# EAGLE schematic Powerswitch 2 Dioda dan MPU6050 (EAGLE 9.6.2)
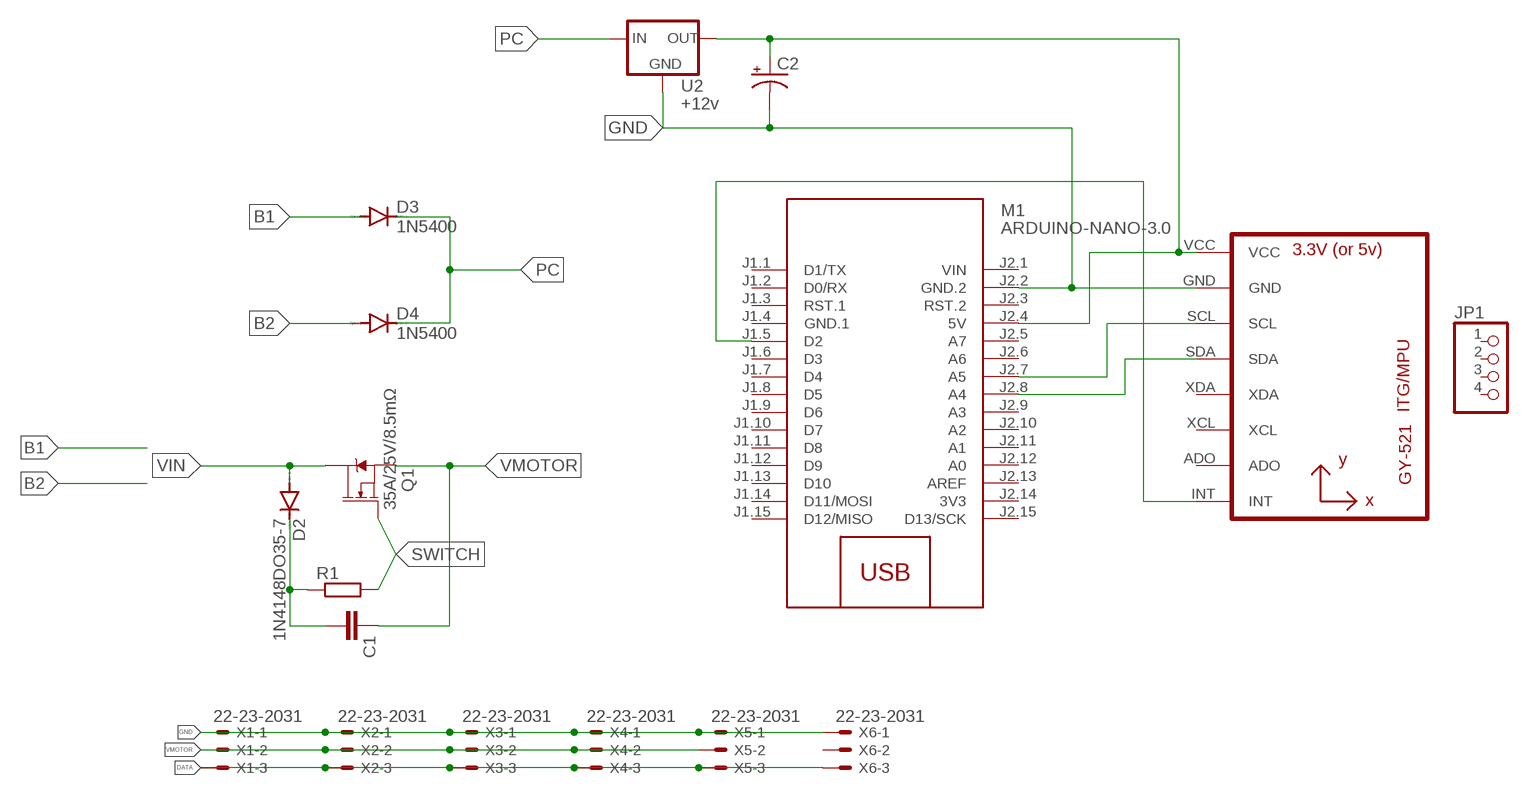
[diagram p0: schematic, sheet 1]

## Parts
C1  C-EU025-030X050  [C025-030X050]
C2  CPOL-USE2-5  [E2-5]
D2  1N4148DO35-7  [DO35-7]
D3  1N5400  [DO201-15]
D4  1N5400  [DO201-15]
JP1  PINHD-1X4  [1X04]
M1  ARDUINO-NANO-3.0  [ARDUINO-NANO-3.0]
Q1  35A/25V/8.5mΩ  MOSFET-NCH-FDD8780  [DPAK]
R1  R-EU_0207/10  [0207/10]
U1  GY-521MPU6050  [GY-521]
U2  +12v  V_REG_78XX7812  [TO-252]
X1  22-23-2031  [22-23-2031]
X2  22-23-2031  [22-23-2031]
X3  22-23-2031  [22-23-2031]
X4  22-23-2031  [22-23-2031]
X5  22-23-2031  [22-23-2031]
X6  22-23-2031  [22-23-2031]

## Nets
B1: D3.A
B2: D4.A
DATA: X1.3 X2.3 X3.3 X4.3 X5.3 X6.3
GND: C2.- M1.J2.2(GND.2) U1.GND U2.3(GND) X1.1 X2.1 X3.1 X4.1 X5.1 X6.1
N$4: M1.J2.8(A4) U1.SDA
N$5: C1.2 D2.C R1.1
N$6: M1.J2.7(A5) U1.SCL
N$9: M1.J1.5(D2) U1.INT
N$11: C2.+ M1.J2.4(5V) U1.VCC U2.2(OUT)
PC: D3.C D4.C U2.1(IN)
SWITCH: Q1.1(G) R1.2
VIN: D2.A Q1.4(D)
VMOTOR: C1.1 Q1.3(S) X1.2 X2.2 X3.2 X4.2 X5.2
Unconnected: JP1.1 JP1.2 JP1.3 JP1.4 M1.J1.1(D1/TX) M1.J1.2(D0/RX) M1.J1.3(RST.1) M1.J1.6(D3) M1.J1.7(D4) M1.J1.8(D5) M1.J1.9(D6) M1.J1.10(D7) M1.J1.11(D8) M1.J1.12(D9) M1.J1.13(D10) M1.J1.14(D11/MOSI) M1.J1.15(D12/MISO) M1.J2.3(RST.2) M1.J2.5(A7) M1.J2.6(A6) M1.J2.9(A3) M1.J2.10(A2) M1.J2.11(A1) M1.J2.12(A0) M1.J2.13(AREF) M1.J2.15(D13/SCK) U1.ADO U1.XCL U1.XDA X6.2

## Power pins joined to a net without a drawn wire
3V3: M1.J2.14(3V3)
GND.1: M1.J1.4(GND.1)
VIN: M1.J2.1(VIN)

## Library data of the parts
C1 = rcl:C-EU: CAPACITOR, European symbol; SPICEPREFIX: C
C2 = rcl:CPOL-US: POLARIZED CAPACITOR, American symbol; SPICEPREFIX: C
D2 = diode:1N4148: DIODE high speed (Philips)
D3 D4 = diode:1N5400: DIODE standard rectifier, 3 A, 50 V (Motorola)
JP1 = pinhead:PINHD-1X4: PIN HEADER
M1 = diy-modules:ARDUINO-NANO-3.0: Arduino Nano 3.0 and compatible devices More details available here: https://www.arduino.cc/en/Main/ArduinoBoardNano Click here to find device on ebay.com <http://www.ebay.com/sch/arduino+nano>
Q1 = SparkFun-DiscreteSemi:MOSFET-NCH: N-channel MOSFETs Voltage controlled devices that allow control of high current outputs. SparkFun Products: SparkFun OpenScale <https://www.sparkfun.com/products/13261> SparkFun Digital Sandbox <https://www.sparkfun.com/products/12651> SparkFun Monster Moto Shield <https://www.sparkfun.com/products/10182> SparkFun MOSFET Power Controller <https://www.sparkfun.com/products/11214>; PROD_ID: TRANS-09984
R1 = rcl:R-EU_: RESISTOR, European symbol; SPICEPREFIX: R
U1 = gy-521:GY-521
U2 = SparkFun-IC-Power:V_REG_78XX: Voltage Regulator Standard 78xx regulator. IGO (Input Ground Output). Spark Fun Electronics SKU : COM-00107; PROD_ID: VREG-12370
X1-X6 = con-molex:22-23-2031: .100" (2.54mm) Center Header - 3 Pin; MF: MOLEX; MPN: 22-23-2031; OC_FARNELL: 1462950; OC_NEWARK: 30C0862